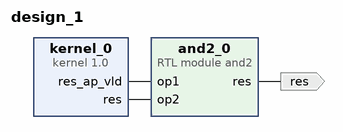
[diagram p0: block diagram of the top level]
# Vivado block design design_1, xc7a35tcpg236-1, Vivado 2019.2
create_bd_design design_1

create_bd_port -dir O res

create_bd_cell -type module -reference and2 and2_0
create_bd_cell -type ip -vlnv TeamMLG:hls:kernel:1.0 kernel_0

# ---- connections ----

connect_bd_net [get_bd_pins and2_0/res] [get_bd_ports res]
connect_bd_net [get_bd_pins kernel_0/res_ap_vld] [get_bd_pins and2_0/op1]
connect_bd_net [get_bd_pins kernel_0/res] [get_bd_pins and2_0/op2]

validate_bd_design
save_bd_design
